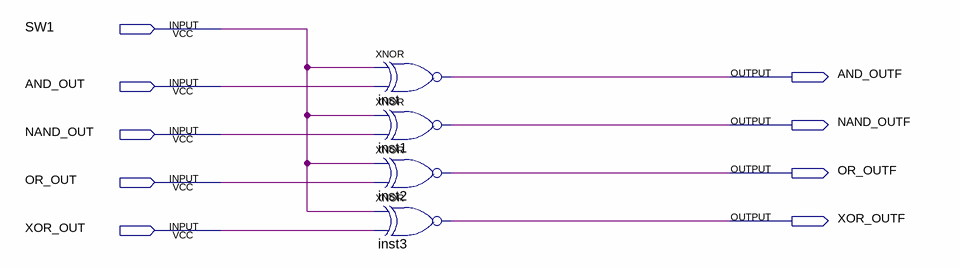
[diagram p0: schematic sheet]
// Quartus schematic Polarity_gates.bdf as structural Verilog: 4 symbols, 9 pins
module Polarity_gates (
  input  SW1,
  input  AND_OUT,
  input  NAND_OUT,
  input  OR_OUT,
  input  XOR_OUT,
  output AND_OUTF,
  output NAND_OUTF,
  output OR_OUTF,
  output XOR_OUTF
);

  xnor inst (AND_OUTF, SW1, AND_OUT);
  xnor inst1 (NAND_OUTF, SW1, NAND_OUT);
  xnor inst2 (OR_OUTF, SW1, OR_OUT);
  xnor inst3 (XOR_OUTF, SW1, XOR_OUT);
endmodule
